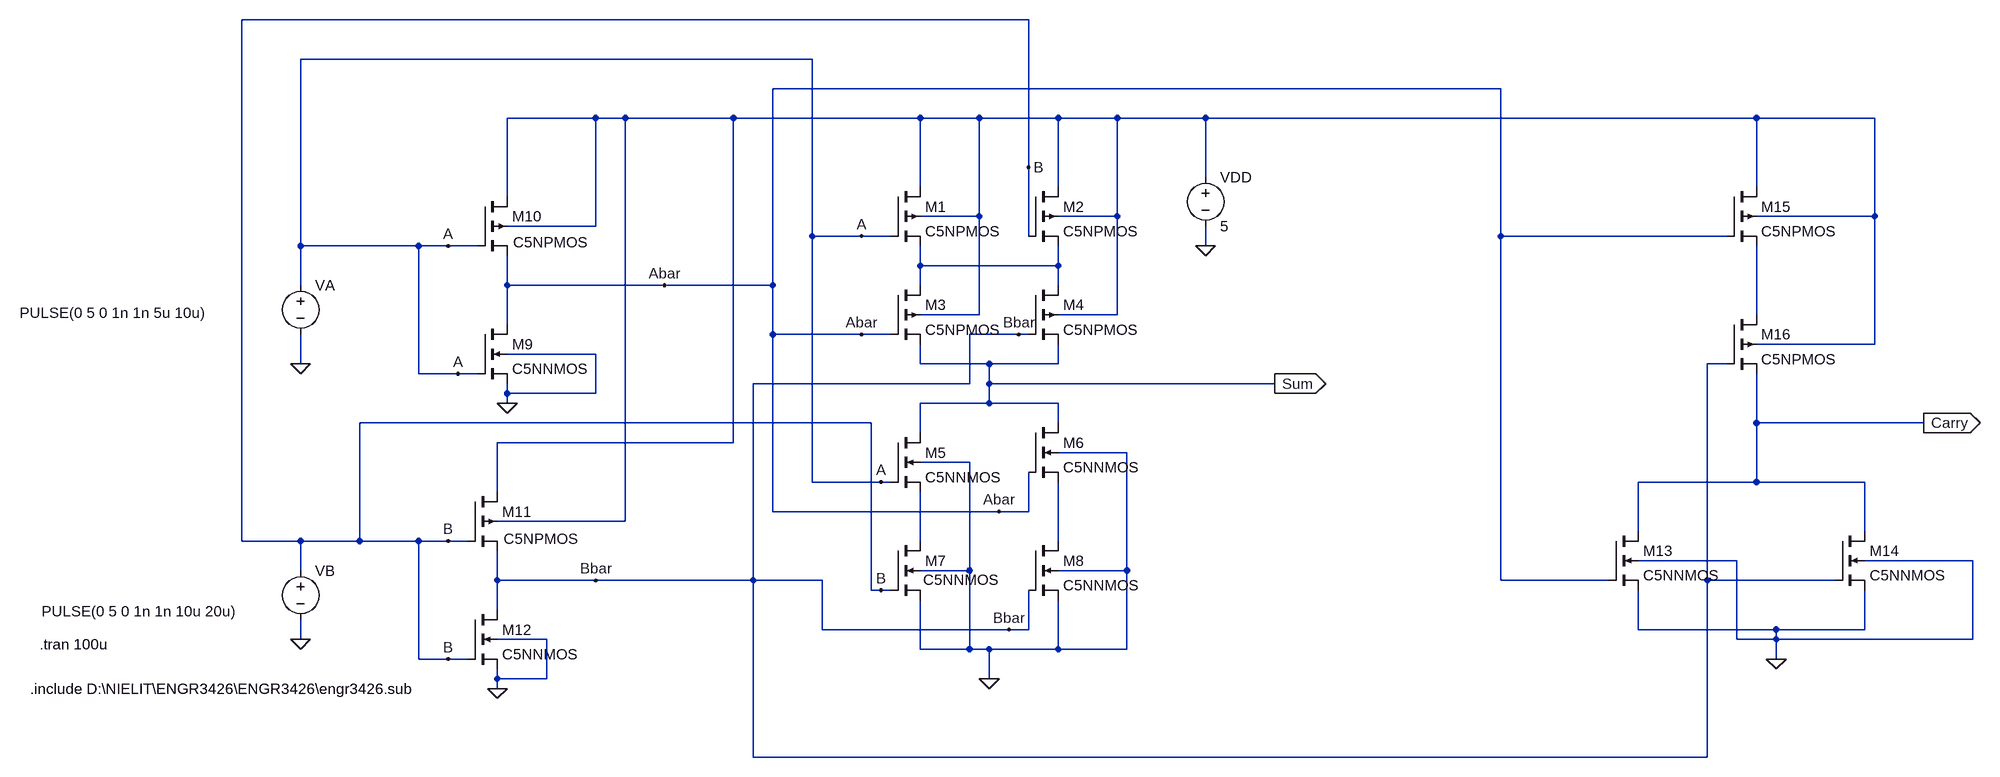
[diagram p0: schematic HALF_ADDER.asc]
HALF_ADDER.asc, the LTspice schematic file:
Version 4
SHEET 1 1868 1000
WIRE 288 -224 -992 -224
WIRE -64 -160 -896 -160
WIRE 1056 -112 -128 -112
WIRE -416 -64 -560 -64
WIRE -368 -64 -416 -64
WIRE -192 -64 -368 -64
WIRE 112 -64 -192 -64
WIRE 208 -64 112 -64
WIRE 336 -64 208 -64
WIRE 432 -64 336 -64
WIRE 576 -64 432 -64
WIRE 1472 -64 576 -64
WIRE 1664 -64 1472 -64
WIRE 288 16 288 -224
WIRE 576 32 576 -64
WIRE 112 48 112 -64
WIRE 336 48 336 -64
WIRE 1472 48 1472 -64
WIRE -560 64 -560 -64
WIRE 208 96 208 -64
WIRE 208 96 112 96
WIRE 432 96 432 -64
WIRE 432 96 336 96
WIRE 1664 96 1664 -64
WIRE 1664 96 1472 96
WIRE -416 112 -416 -64
WIRE -416 112 -560 112
WIRE -64 128 -64 -160
WIRE 16 128 -64 128
WIRE 64 128 16 128
WIRE 288 128 288 16
WIRE 1056 128 1056 -112
WIRE 1424 128 1056 128
WIRE -896 144 -896 -160
WIRE -704 144 -896 144
WIRE -656 144 -704 144
WIRE -608 144 -656 144
WIRE 576 144 576 112
WIRE 112 176 112 144
WIRE 336 176 336 144
WIRE 336 176 112 176
WIRE -896 208 -896 144
WIRE -560 208 -560 160
WIRE -304 208 -560 208
WIRE -128 208 -128 -112
WIRE -128 208 -304 208
WIRE 112 208 112 176
WIRE 336 208 336 176
WIRE 208 256 208 96
WIRE 208 256 112 256
WIRE 432 256 432 96
WIRE 432 256 336 256
WIRE 1472 256 1472 144
WIRE -560 272 -560 208
WIRE -128 288 -128 208
WIRE 16 288 -128 288
WIRE 64 288 16 288
WIRE 272 288 192 288
WIRE 288 288 272 288
WIRE 1664 304 1664 96
WIRE 1664 304 1472 304
WIRE -416 320 -560 320
WIRE -896 336 -896 288
WIRE 112 336 112 304
WIRE 224 336 112 336
WIRE 336 336 336 304
WIRE 336 336 224 336
WIRE 1424 336 1392 336
WIRE -704 352 -704 144
WIRE -640 352 -704 352
WIRE -608 352 -640 352
WIRE 192 368 192 288
WIRE 192 368 -160 368
WIRE 224 368 224 336
WIRE 688 368 224 368
WIRE -560 384 -560 368
WIRE -416 384 -416 320
WIRE -416 384 -560 384
WIRE -560 400 -560 384
WIRE 224 400 224 368
WIRE 224 400 112 400
WIRE 336 400 224 400
WIRE 32 432 -800 432
WIRE 336 432 336 400
WIRE 1472 432 1472 352
WIRE 1744 432 1472 432
WIRE 112 448 112 400
WIRE -192 464 -192 -64
WIRE -192 464 -576 464
WIRE 448 480 336 480
WIRE 192 496 112 496
WIRE -64 528 -64 128
WIRE 48 528 -64 528
WIRE 64 528 48 528
WIRE 1472 528 1472 432
WIRE 1472 528 1280 528
WIRE 1648 528 1472 528
WIRE -576 544 -576 464
WIRE -128 576 -128 288
WIRE 240 576 -128 576
WIRE 288 576 288 512
WIRE 288 576 240 576
WIRE -368 592 -368 -64
WIRE -368 592 -576 592
WIRE 1280 608 1280 528
WIRE 1648 608 1648 528
WIRE -992 624 -992 -224
WIRE -896 624 -992 624
WIRE -800 624 -800 432
WIRE -800 624 -896 624
WIRE -704 624 -800 624
WIRE -656 624 -704 624
WIRE -624 624 -656 624
WIRE 112 624 112 544
WIRE 336 624 336 528
WIRE 1440 656 1280 656
WIRE 1824 656 1648 656
WIRE -896 672 -896 624
WIRE 192 672 192 496
WIRE 192 672 112 672
WIRE 448 672 448 480
WIRE 448 672 336 672
WIRE -576 688 -576 640
WIRE -416 688 -576 688
WIRE -160 688 -160 368
WIRE -160 688 -416 688
WIRE -48 688 -160 688
WIRE 1056 688 1056 128
WIRE 1232 688 1056 688
WIRE 1392 688 1392 336
WIRE 1600 688 1392 688
WIRE 32 704 32 432
WIRE 48 704 32 704
WIRE 64 704 48 704
WIRE -576 736 -576 688
WIRE -48 768 -48 688
WIRE 256 768 -48 768
WIRE 288 768 288 704
WIRE 288 768 256 768
WIRE 1280 768 1280 704
WIRE 1504 768 1280 768
WIRE 1648 768 1648 704
WIRE 1648 768 1504 768
WIRE -896 784 -896 752
WIRE -496 784 -576 784
WIRE 1440 784 1440 656
WIRE 1504 784 1504 768
WIRE 1504 784 1440 784
WIRE 1824 784 1824 656
WIRE 1824 784 1504 784
WIRE 112 800 112 720
WIRE 192 800 192 672
WIRE 192 800 112 800
WIRE 224 800 192 800
WIRE 336 800 336 720
WIRE 336 800 224 800
WIRE 448 800 448 672
WIRE 448 800 336 800
WIRE -704 816 -704 624
WIRE -656 816 -704 816
WIRE -624 816 -656 816
WIRE 1504 816 1504 784
WIRE -576 848 -576 832
WIRE -496 848 -496 784
WIRE -496 848 -576 848
WIRE 224 848 224 800
WIRE -576 864 -576 848
WIRE -160 976 -160 688
WIRE 1392 976 1392 688
WIRE 1392 976 -160 976
FLAG -896 784 0
FLAG 224 848 0
FLAG -560 400 0
FLAG -576 864 0
FLAG 576 144 0
FLAG -896 336 0
FLAG 688 368 Sum
IOPIN 688 368 Out
FLAG -304 208 Abar
FLAG -416 688 Bbar
FLAG -656 144 A
FLAG -656 624 B
FLAG 16 128 A
FLAG 16 288 Abar
FLAG 288 16 B
FLAG 272 288 Bbar
FLAG 240 576 Abar
FLAG 256 768 Bbar
FLAG 48 704 B
FLAG 48 528 A
FLAG -656 816 B
FLAG -640 352 A
FLAG 1504 816 0
FLAG 1744 432 Carry
IOPIN 1744 432 Out
SYMBOL pmos4 64 48 R0
SYMATTR InstName M1
SYMATTR Value C5NPMOS
SYMATTR Value2 l=0.6u w=7.2u
SYMBOL pmos4 288 48 R0
SYMATTR InstName M2
SYMATTR Value C5NPMOS
SYMATTR Value2 l=0.6u w=7.2u
SYMBOL pmos4 64 208 R0
SYMATTR InstName M3
SYMATTR Value C5NPMOS
SYMATTR Value2 l=0.6u w=7.2u
SYMBOL pmos4 288 208 R0
SYMATTR InstName M4
SYMATTR Value C5NPMOS
SYMATTR Value2 l=0.6u w=7.2u
SYMBOL nmos4 64 448 R0
SYMATTR InstName M5
SYMATTR Value C5NNMOS
SYMATTR Value2 l=0.6u w=3.6u
SYMBOL nmos4 288 432 R0
SYMATTR InstName M6
SYMATTR Value C5NNMOS
SYMATTR Value2 l=0.6u w=3.6u
SYMBOL nmos4 64 624 R0
WINDOW 3 53 63 Left 2
SYMATTR InstName M7
SYMATTR Value C5NNMOS
SYMATTR Value2 l=0.6u w=3.6u
SYMBOL nmos4 288 624 R0
SYMATTR InstName M8
SYMATTR Value C5NNMOS
SYMATTR Value2 l=0.6u w=3.6u
SYMBOL voltage 576 16 R0
SYMATTR InstName VDD
SYMATTR Value 5
SYMBOL voltage -896 192 R0
WINDOW 3 -457 61 Left 2
WINDOW 123 0 0 Left 0
WINDOW 39 0 0 Left 0
SYMATTR InstName VA
SYMATTR Value PULSE(0 5 0 1n 1n 5u 10u)
SYMBOL voltage -896 656 R0
WINDOW 3 -421 82 Left 2
WINDOW 123 0 0 Left 0
WINDOW 39 0 0 Left 0
SYMATTR InstName VB
SYMATTR Value PULSE(0 5 0 1n 1n 10u 20u)
SYMBOL nmos4 -608 272 R0
SYMATTR InstName M9
SYMATTR Value C5NNMOS
SYMATTR Value2 l=0.6u w=3.6u
SYMBOL pmos4 -608 64 R0
WINDOW 3 58 74 Left 2
SYMATTR InstName M10
SYMATTR Value C5NPMOS
SYMATTR Value2 l=0.6u w=7.2u
SYMBOL pmos4 -624 544 R0
WINDOW 3 58 76 Left 2
SYMATTR InstName M11
SYMATTR Value C5NPMOS
SYMATTR Value2 l=0.6u w=7.2u
SYMBOL nmos4 -624 736 R0
SYMATTR InstName M12
SYMATTR Value C5NNMOS
SYMATTR Value2 l=0.6u w=3.6u
SYMBOL nmos4 1232 608 R0
SYMATTR InstName M13
SYMATTR Value C5NNMOS
SYMATTR Value2 l=0.6u w=3.6u
SYMBOL nmos4 1600 608 R0
SYMATTR InstName M14
SYMATTR Value C5NNMOS
SYMATTR Value2 l=0.6u w=3.6u
SYMBOL pmos4 1424 48 R0
SYMATTR InstName M15
SYMATTR Value C5NPMOS
SYMATTR Value2 l=0.6u w=7.2u
SYMBOL pmos4 1424 256 R0
SYMATTR InstName M16
SYMATTR Value C5NPMOS
SYMATTR Value2 l=0.6u w=7.2u
TEXT -1320 792 Left 2 !.tran 100u
TEXT -1336 864 Left 2 !.include D:\\NIELIT\\ENGR3426\\ENGR3426\\engr3426.sub

The netlist it stands for:
* HALF_ADDER.asc
M1 N001 A N002 N001 C5NPMOS l=0.6u w=7.2u
M2 N001 B N002 N001 C5NPMOS l=0.6u w=7.2u
M3 N002 Abar Sum N001 C5NPMOS l=0.6u w=7.2u
M4 N002 Bbar Sum N001 C5NPMOS l=0.6u w=7.2u
M5 Sum A N004 0 C5NNMOS l=0.6u w=3.6u
M6 Sum Abar N005 0 C5NNMOS l=0.6u w=3.6u
M7 N004 B 0 0 C5NNMOS l=0.6u w=3.6u
M8 N005 Bbar 0 0 C5NNMOS l=0.6u w=3.6u
VDD N001 0 5
VA A 0 PULSE(0 5 0 1n 1n 5u 10u)
VB B 0 PULSE(0 5 0 1n 1n 10u 20u)
M9 Abar A 0 0 C5NNMOS l=0.6u w=3.6u
M10 N001 A Abar N001 C5NPMOS l=0.6u w=7.2u
M11 N001 B Bbar N001 C5NPMOS l=0.6u w=7.2u
M12 Bbar B 0 0 C5NNMOS l=0.6u w=3.6u
M13 Carry Abar 0 0 C5NNMOS l=0.6u w=3.6u
M14 Carry Bbar 0 0 C5NNMOS l=0.6u w=3.6u
M15 N001 Abar N003 N001 C5NPMOS l=0.6u w=7.2u
M16 N003 Bbar Carry N001 C5NPMOS l=0.6u w=7.2u
.model NMOS NMOS
.model PMOS PMOS
.lib standard.mos
.tran 100u
.include D:\NIELIT\ENGR3426\ENGR3426\engr3426.sub
.backanno
.end